# Altium schematic sheet SoC_Decoupling.SchDoc: RFSoC AMC
size 420 x 297 mm; CompanyName: WUT; DrawnBy: T. Przywozki; Organization: WUT ISE; Address1: Warsaw University of Technology; Address2: Nowowiejska 15/19 00-665 Warsaw; Address3: Tomasz.Przywozki@pw.edu.pl; DocumentNumber: 42; Revision: 1; SheetNumber: 42; SheetTotal: 45; Project: RFSoC AMC; ModifiedBy: T. Przywozki; CreateDate: -; CheckedDate: -; DivGrp: ISE; Designer: T. Przywozki; ModifiedDate: -; ProjectName: ADC/DAC MEZZANINE
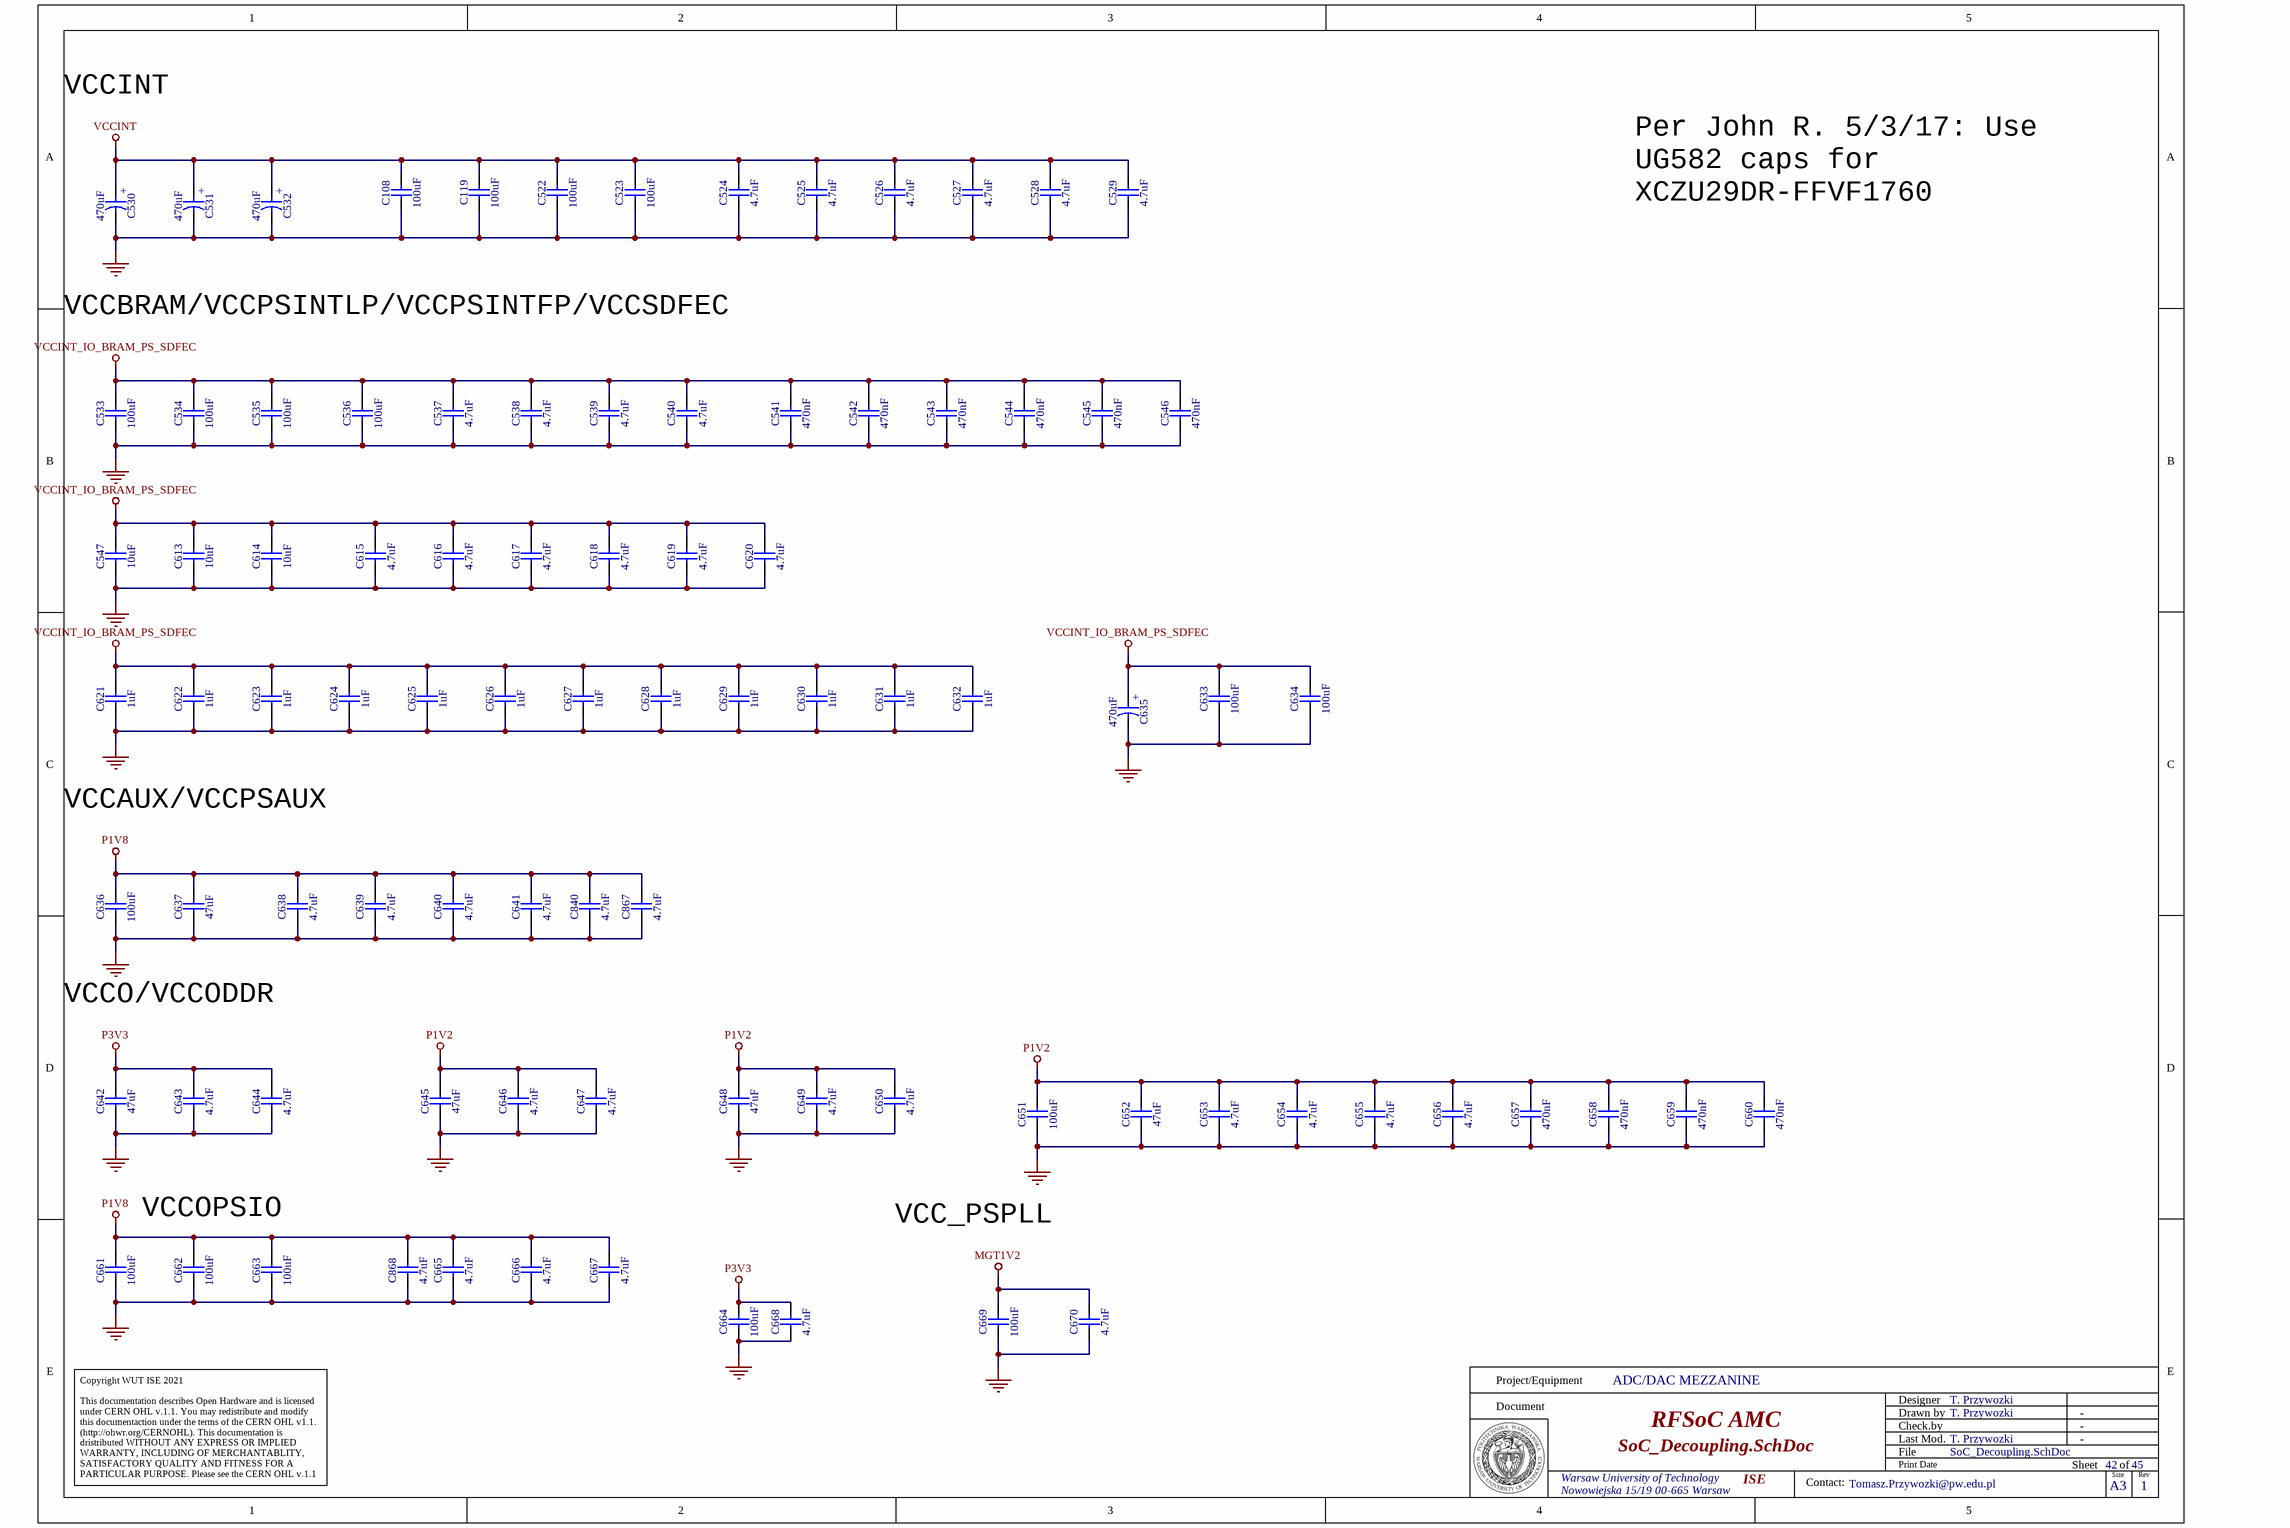
[diagram p0: SoC_Decoupling.SchDoc]

## Parts
C108  100uF  [CAPC3216X180N]
C119  100uF  [CAPC3216X180N]
C522  100uF  [CAPC3216X180N]
C523  100uF  [CAPC3216X180N]
C524  4.7uF  [CAPC1005X55N]
C525  4.7uF  [CAPC1005X55N]
C526  4.7uF  [CAPC1005X55N]
C527  4.7uF  [CAPC1005X55N]
C528  4.7uF  [CAPC1005X55N]
C529  4.7uF  [CAPC1005X55N]
C530  470uF  [CAPMP7343X200N]
C531  470uF  [CAPMP7343X200N]
C532  470uF  [CAPMP7343X200N]
C533  100uF  [CAPC3225X270N]
C534  100uF  [CAPC3225X270N]
C535  100uF  [CAPC3225X270N]
C536  100uF  [CAPC3225X270N]
C537  4.7uF  [CAPC1005X55N]
C538  4.7uF  [CAPC1005X55N]
C539  4.7uF  [CAPC1005X55N]
C540  4.7uF  [CAPC1005X55N]
C541  470nF  [CAPC1005X55N]
C542  470nF  [CAPC1005X55N]
C543  470nF  [CAPC1005X55N]
C544  470nF  [CAPC1005X55N]
C545  470nF  [CAPC1005X55N]
C546  470nF  [CAPC1005X55N]
C547  10uF  [CAPC1608X80N]
C613  10uF  [CAPC1608X80N]
C614  10uF  [CAPC1608X80N]
C615  4.7uF  [CAPC1005X55N]
C616  4.7uF  [CAPC1005X55N]
C617  4.7uF  [CAPC1005X55N]
C618  4.7uF  [CAPC1005X55N]
C619  4.7uF  [CAPC1005X55N]
C620  4.7uF  [CAPC1005X55N]
C621  1uF  [CAPC1005X55N]
C622  1uF  [CAPC1005X55N]
C623  1uF  [CAPC1005X55N]
C624  1uF  [CAPC1005X55N]
C625  1uF  [CAPC1005X55N]
C626  1uF  [CAPC1005X55N]
C627  1uF  [CAPC1005X55N]
C628  1uF  [CAPC1005X55N]
C629  1uF  [CAPC1005X55N]
C630  1uF  [CAPC1005X55N]
C631  1uF  [CAPC1005X55N]
C632  1uF  [CAPC1005X55N]
C633  100uF  [CAPC3225X270N]
C634  100uF  [CAPC3225X270N]
C635  470uF  [CAPMP7343X200N]
C636  100uF  [CAPC3225X270N]
C637  47uF  [CAPC1608X100N]
C638  4.7uF  [CAPC1005X55N]
C639  4.7uF  [CAPC1005X55N]
C640  4.7uF  [CAPC1005X55N]
C641  4.7uF  [CAPC1005X55N]
C642  47uF  [CAPC1608X100N]
C643  4.7uF  [CAPC1005X55N]
C644  4.7uF  [CAPC1005X55N]
C645  47uF  [CAPC1608X100N]
C646  4.7uF  [CAPC1005X55N]
C647  4.7uF  [CAPC1005X55N]
C648  47uF  [CAPC1608X100N]
C649  4.7uF  [CAPC1005X55N]
C650  4.7uF  [CAPC1005X55N]
C651  100uF  [CAPC3225X270N]
C652  47uF  [CAPC1608X100N]
C653  4.7uF  [CAPC1005X55N]
C654  4.7uF  [CAPC1005X55N]
C655  4.7uF  [CAPC1005X55N]
C656  4.7uF  [CAPC1005X55N]
C657  470nF  [CAPC1005X55N]
C658  470nF  [CAPC1005X55N]
C659  470nF  [CAPC1005X55N]
C660  470nF  [CAPC1005X55N]
C661  100uF  [CAPC3225X270N]
C662  100uF  [CAPC3225X270N]
C663  100uF  [CAPC3225X270N]
C664  100uF  [CAPC3225X270N]
C665  4.7uF  [CAPC1005X55N]
C666  4.7uF  [CAPC1005X55N]
C667  4.7uF  [CAPC1005X55N]
C668  4.7uF  [CAPC1005X55N]
C669  100uF  [CAPC3216X180N]
C670  4.7uF  [CAPC1005X55N]
C840  4.7uF  [CAPC1005X55N]
C867  4.7uF  [CAPC1005X55N]
C868  4.7uF  [CAPC1005X55N]

## Nets
GND: C108.1 C119.1 C522.1 C523.1 C524.1 C525.1 C526.1 C527.1 C528.1 C529.1 C530.2 C531.2 C532.2 C533.1 C534.1 C535.1 C536.1 C537.1 C538.1 C539.1 C540.1 C541.1 C542.1 C543.1 C544.1 C545.1 C546.1 C547.1 C613.1 C614.1 C615.1 C616.1 C617.1 C618.1 C619.1 C620.1 C621.1 C622.1 C623.1 C624.1 C625.1 C626.1 C627.1 C628.1 C629.1 C630.1 C631.1 C632.1 C633.1 C634.1 C635.2 C636.1 C637.1 C638.1 C639.1 C640.1 C641.1 C642.1 C643.1 C644.1 C645.1 C646.1 C647.1 C648.1 C649.1 C650.1 C651.1 C652.1 C653.1 C654.1 C655.1 C656.1 C657.1 C658.1 C659.1 C660.1 C661.1 C662.1 C663.1 C664.1 C665.1 C666.1 C667.1 C668.1 C669.1 C670.1 C840.1 C867.1 C868.1
MGT1V2: C669.2 C670.2
P1V2: C645.2 C646.2 C647.2 C648.2 C649.2 C650.2 C651.2 C652.2 C653.2 C654.2 C655.2 C656.2 C657.2 C658.2 C659.2 C660.2
P1V8: C636.2 C637.2 C638.2 C639.2 C640.2 C641.2 C661.2 C662.2 C663.2 C665.2 C666.2 C667.2 C840.2 C867.2 C868.2
P3V3: C642.2 C643.2 C644.2 C664.2 C668.2
VCCINT: C108.2 C119.2 C522.2 C523.2 C524.2 C525.2 C526.2 C527.2 C528.2 C529.2 C530.1 C531.1 C532.1
VCCINT_IO_BRAM_PS_SDFEC: C533.2 C534.2 C535.2 C536.2 C537.2 C538.2 C539.2 C540.2 C541.2 C542.2 C543.2 C544.2 C545.2 C546.2 C547.2 C613.2 C614.2 C615.2 C616.2 C617.2 C618.2 C619.2 C620.2 C621.2 C622.2 C623.2 C624.2 C625.2 C626.2 C627.2 C628.2 C629.2 C630.2 C631.2 C632.2 C633.2 C634.2 C635.1

## Notes on the sheet
- VCCINT
- Per John R. 5/3/17: Use
  UG582 caps for
  XCZU29DR-FFVF1760
- VCCBRAM/VCCPSINTLP/VCCPSINTFP/VCCSDFEC
- VCCAUX/VCCPSAUX
- VCCO/VCCODDR
- VCCOPSIO
- VCC_PSPLL
- Project/Equipment
- Document
- Designer
- Drawn by
- Check.by
- Copyright WUT ISE 2021
  This documentation describes Open Hardware and is licensed under CERN OHL v.1.1. You may redistribute and modify this documentaction under the terms of the CERN OHL v1.1.
  (http://ohwr.org/CERNOHL). This documentation is dristributed WITHOUT ANY EXPRESS OR IMPLIED WARRANTY, INCLUDING OF MERCHANTABLITY, SATISFACTORY QUALITY AND FITNESS FOR A PARTICULAR PURPOSE. Please see the CERN OHL v.1.1 for applicable conditions
- File
- Last Mod.
- Print Date
- Sheet
- Size
- A3
- of
- Rev
- Contact:
- (in symbol CAEM7343-20_470UF_2V_20%_LESR0003_PANASONIC_EEFGX0D471R) +

## Library data of the parts
C108 C119 C522 C523 C669 = CC1206_100UF_6.3V_20%_X5R: Non-polarised capacitor; Part Description: SMD Multilayer Chip Ceramic Capacitor; Manufacturer: GENERIC; Manufacturer1 Part Number: C1206C107M9PACTU; Voltage: 6.3V; Tolerance: ±10%; TC: X5R; Part Number: CC1206_100UF_6.3V_20%_X5R; Component Kind: Standard; Component Type: Standard; Pin Count: 2; Value: 100uF; Status: None; Manufacturer Part Number: CC1206_100UF_6.3V_20%_X5R; Case: 1206; Mounted: Yes; Socket: No; SMD: Yes; Sense: No; Manufacturer1 Example: KEMET; Manufacturer1 ComponentHeight: 1.8mm; HelpURL: \\cern.ch\dfs\Applications\Altium\Datasheets\CC1206_X5R_KEMET.pdf; Author: CERN DEM JLC; CreateDate: 26.09.2012; LatestRevisionDate: 26.09.2012
C524-C529 C537-C540 C615-C620 C638-C641 C643 C644 C646 C647 C649 C650 C653-C656 C665-C668 C670 C840 C867 C868 = CC0402_4.7UF_6.3V_20%_X5R: Non-polarised capacitor; Part Description: SMD Multilayer Chip Ceramic Capacitor; Manufacturer: GENERIC; Manufacturer1 Part Number: C1005X5R0J475M050BC; Voltage: 6.3V; Tolerance: ±20%; TC: X5R; Part Number: CC0402_4.7UF_6.3V_20%_X5R; Component Kind: Standard; Component Type: Standard; Pin Count: 2; Value: 4.7uF; Status: Preferred; Manufacturer Part Number: CC0402_4.7UF_6.3V_20%_X5R; Case: 0402; Mounted: Yes; Socket: No; SMD: Yes; Sense: No; Manufacturer1 Example: TDK; Manufacturer1 ComponentHeight: 0.65mm; HelpURL: \\cern.ch\dfs\Applications\Altium\Datasheets\CC0402_X5R_TDK_C.pdf; Author: CERN DEM JLC; CreateDate: 03.03.2015; LatestRevisionDate: 03.03.2015
C530-C532 C635 = CAEM7343-20_470UF_2V_20%_LESR0003_PANASONIC_EEFGX0D471R: Polarised capacitor; Part Description: ESR 0R003 Polymer Aluminum Electrolytic Capacitor; Voltage: 2V; Tolerance: ±20%; Part Number: CAEM7343-20_470UF_2V_20%_LESR0003_PANASONIC_EEFGX0D471R; Component Kind: Standard; Component Type: Standard; Pin Count: 2; Value: 470uF; Status: None; Manufacturer: PANASONIC; Manufacturer Part Number: EEFGX0D471R; Mounted: Yes; Socket: No; SMD: Yes; Sense: No; ComponentHeight: 2mm; HelpURL: \\cern.ch\dfs\Applications\Altium\Datasheets\CAEM_PANASONIC_EEFGX.pdf; Author: CERN DEM MR; CreateDate: 26.05.2016; LatestRevisionDate: 14.03.2017
C533-C536 C633 C634 C636 C651 C661-C664 = CC1210_100UF_6.3V_20%_X5R: Non-polarised capacitor; Part Description: SMD Multilayer Chip Ceramic Capacitor; Manufacturer: GENERIC; Manufacturer1 Part Number: GRM32ER60J107ME20L; Voltage: 6.3V; Tolerance: ±20%; TC: X5R; Part Number: CC1210_100UF_6.3V_20%_X5R; Component Kind: Standard; Component Type: Standard; Pin Count: 2; Value: 100uF; Status: Preferred; Manufacturer Part Number: CC1210_100UF_6.3V_20%_X5R; Case: 1210; Mounted: Yes; Socket: No; SMD: Yes; Sense: No; Manufacturer1 Example: MURATA; Manufacturer1 ComponentHeight: 2.7mm; HelpURL: \\cern.ch\dfs\Applications\Altium\Datasheets\CC1210_X5R_MURATA.pdf; Author: CERN DEM JLC; CreateDate: 19.04.2010; LatestRevisionDate: 19.04.2010
C541-C546 C657-C660 = CC0402_470NF_16V_10%_X5R: Non-polarised capacitor; Part Description: SMD Multilayer Chip Ceramic Capacitor; Manufacturer: GENERIC; Manufacturer1 Part Number: C1005X5R1C105KT; Voltage: 16V; Tolerance: ±10%; TC: X5R; Part Number: CC0402_470NF_16V_10%_X5R; Component Kind: Standard; Component Type: Standard; Pin Count: 2; Value: 470nF; Status: Preferred; Manufacturer Part Number: CC0402_470NF_16V_10%_X5R; Case: 0402; Mounted: Yes; Socket: No; SMD: Yes; Sense: No; Manufacturer1 Example: TDK; Manufacturer1 ComponentHeight: 0.55mm; HelpURL: \\cern.ch\dfs\Applications\Altium\Datasheets\CC0402_X5R_TDK_C.pdf; Author: CERN DEM JLC; CreateDate: 25.10.2012; LatestRevisionDate: 25.10.2012
C547 C613 C614 = CC0603_10UF_10V_10%_X5R: Non-polarised capacitor; Part Description: SMD Multilayer Chip Ceramic Capacitor; Manufacturer: GENERIC; Manufacturer1 Part Number: GRM188R61A106KE69D; Voltage: 10V; Tolerance: ±10%; TC: X5R; Part Number: CC0603_10UF_10V_10%_X5R; Component Kind: Standard; Component Type: Standard; Pin Count: 2; Value: 10uF; Status: None; Manufacturer Part Number: CC0603_10UF_10V_10%_X5R; Case: 0603; Mounted: Yes; Socket: No; SMD: Yes; Sense: No; Manufacturer1 Example: MURATA; Manufacturer1 ComponentHeight: 0.8mm; HelpURL: \\cern.ch\dfs\Applications\Altium\Datasheets\CC0603_MURATA_GRM188R61A106KE69D.pdf; Author: CERN DEM JLC; CreateDate: 31.01.2017; LatestRevisionDate: 31.01.2017
C621-C632 = CC0402_1UF_16V_10%_X5R: Non-polarised capacitor; Part Description: SMD Multilayer Chip Ceramic Capacitor; Manufacturer: GENERIC; Manufacturer1 Part Number: C1005X5R1C105KT; Voltage: 16V; Tolerance: ±10%; TC: X5R; Part Number: CC0402_1UF_16V_10%_X5R; Component Kind: Standard; Component Type: Standard; Pin Count: 2; Value: 1uF; Status: Preferred; Manufacturer Part Number: CC0402_1UF_16V_10%_X5R; Case: 0402; Mounted: Yes; Socket: No; SMD: Yes; Sense: No; Manufacturer1 Example: TDK; Manufacturer1 ComponentHeight: 0.55mm; HelpURL: \\cern.ch\dfs\Applications\Altium\Datasheets\CC0402_X5R_TDK_C.pdf; Author: CERN DEM JLC; CreateDate: 25.10.2012; LatestRevisionDate: 25.10.2012
C637 C642 C645 C648 C652 = CC0603_47UF_6.3V_20%_X5R: Non-polarised capacitor; Part Description: SMD Multilayer Chip Ceramic Capacitor; Manufacturer: GENERIC; Manufacturer1 Part Number: GRM188R60J476ME15D; Voltage: 6.3V; Tolerance: ±20%; TC: X5R; Part Number: CC0603_47UF_6.3V_20%_X5R; Component Kind: Standard; Component Type: Standard; Pin Count: 2; Value: 47uF; Status: None; Manufacturer Part Number: CC0603_47UF_6.3V_20%_X5R; Case: 0603; Mounted: Yes; Socket: No; SMD: Yes; Sense: No; Manufacturer1 Example: MURATA; Manufacturer1 ComponentHeight: 1mm; HelpURL: \\cern.ch\dfs\Applications\Altium\Datasheets\CC0603_MURATA_GRM188R60J476ME15D.pdf; Author: CERN DEM JLC; CreateDate: 01.02.2018; LatestRevisionDate: 01.02.2018